# EAGLE design APDS-9200 (EAGLE 8.2.2)
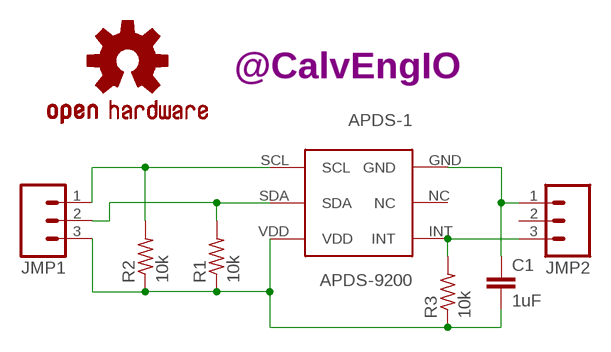
[diagram p0: schematic, sheet 1]

## Parts
APDS-1  APDS-9200  [APDS-9200]
C1  1uF  CAPACITOR0402  [C0402]
JMP1  JMP-03  [1X03@1]
JMP2  JMP-03  [1X03@1]
LOGO1  OSHW-LOGOMINI  [OSHW-LOGO-MINI]
R1  10k  RESISTOR0402  [R0402]
R2  10k  RESISTOR0402  [R0402]
R3  10k  RESISTOR0402  [R0402]
U$1  CALVENGIO_HANDLEHANDLE.025  [CALVENGIO_HANDLE.025]

## Nets
N$1: APDS-1.VDD C1.2 JMP1.3 R1.1 R2.1 R3.1
N$2: APDS-1.GND C1.1 JMP2.1
N$3: APDS-1.INT JMP2.3 R3.2
N$4: APDS-1.SDA JMP1.2 R1.2
N$5: APDS-1.SCL JMP1.1 R2.2
Unconnected: APDS-1.NC JMP2.2

## Library data of the parts
APDS-1 = CalvEngIO-Sensors:APDS-9200
C1 = CalvEngIO-Passives:CAPACITOR
JMP1 JMP2 = CalvEngIO-Connectors:JMP-03
LOGO1 = CalvEngIO-Logos:OSHW-LOGO: Open-Source Hardware (OSHW) Logo This logo indicates the piece of hardware it is found on incorporates a OSHW license and/or adheres to the definition of open source hardware found here: http://freedomdefined.org/OSHW
R1-R3 = CalvEngIO-Passives:RESISTOR
U$1 = CalvEngIO-Logos:CALVENGIO_HANDLE

## Board
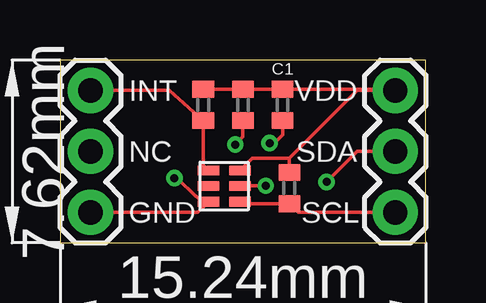
[diagram p1: board, top side]
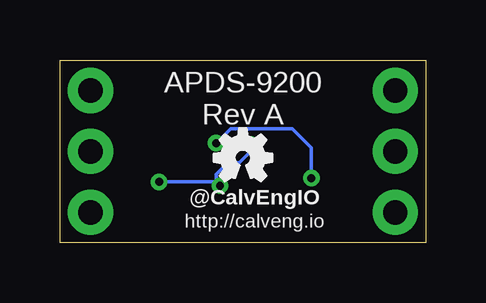
[diagram p2: board, bottom side, seen from below]

Size 15.24 x 7.62 mm. Coordinates in mm from the lower left corner, seen from the top.
Outline: 0,0 15.24,0 15.24,7.62 0,7.62 0,0
Copper layers (1*16): Top 0.0356mm / dielectric 1.5011mm / Bottom 0.0356mm
Design rules "LaenPCBOrder": minimum track width 6mil, minimum drill 13mil, track to track 6mil, track to pad 6mil, pad to pad 6mil, via to via 6mil, smd to smd 6mil, copper to edge 15mil, drill to drill 6mil, minimum pad ring 7mil, minimum via ring 7mil, stop-mask expansion 3mil, vias tented up to drill 0mil, thermal gap 10mil

### Footprints (pad centres in the part's own frame; a part is rotated, then mirrored left to right if it is on the bottom)
APDS-9200 = smd 0.4 x 0.9: GND 1.65,-1.65; INT 0.35,-1.65; NC 1,-1.65; SCL 1.65,-0.35; SDA 1,-0.35; VDD 0.35,-0.35
C0402 = smd 0.7 x 0.9: 1 -0.65,0; 2 0.65,0
1X03@1 = drill 1.016 pad 1.88: 1 0,0; 2 2.54,0; 3 5.08,0
R0402 = smd 0.7 x 0.9: 1 -0.65,0; 2 0.65,0

### Placement (x,y rotation side)
APDS-1  7.84,3.37 270 top
C1  9.27,5.75 90 top
JMP1  13.97,1.27 90 top
JMP2  1.27,1.27 90 top
LOGO1  7.62,3.56 0 bottom
R1  7.62,5.75 270 top
R2  9.56,2.29 270 top
R3  5.97,5.75 270 top
U$1  7.3,1.59 0 bottom

### Tracks (layer width: path | path; a pad name or v marks a point on that pad's centre or on a via)
N$1
  Top 0.152: R3.1 R1.1 C1.2 13.92,6.4 JMP1.3 12.38,6.35 9.56,3.52 | R2.1 9.56,3.52 | 9.56,3.52 8,3.52 APDS-1.VDD
N$2  (via drill 0.33)
  Top 0.152: JMP2.1 5.75,1.27 6.05,1.57 | 6.05,1.57 APDS-1.GND | C1.1 9.27,4.51 9.05,4.29 8.89,4.29 v8.73,4.15 | 6.05,1.57 5.68,1.94 5.65,1.94 4.89,2.7 v4.76,2.7
  Bottom 0.152: v4.76,2.7 4.76,3.97 5.56,4.76 8.12,4.76 v8.73,4.15
N$3
  Top 0.152: JMP2.3 4.56,6.35 R3.2 5.97,3.24 APDS-1.INT
N$4  (via drill 0.33)
  Top 0.152: JMP1.2 12.38,3.81 v11.11,2.54 | v8.57,2.38 7.51,2.38 APDS-1.SDA | R1.2 7.62,4.41 v7.3,4.1
  Bottom 0.152: 8.73,2.54 v11.11,2.54 | 8.73,2.54 v8.57,2.38 | 8.73,2.54 8.73,2.86 8.26,3.33 7.78,3.33 7.3,3.81 v7.3,4.1
N$5
  Top 0.152: APDS-1.SCL 7.57,1.64 R2.2 9.92,1.27 JMP1.1

### Text on the board
tPlace: INT | VDD | NC | SDA | GND | SCL
bPlace: APDS-9200 / Rev A | http://calveng.io